# Altium schematic sheet HDMI.SchDoc
size A4; SheetNumber: 4; SheetTotal: 11
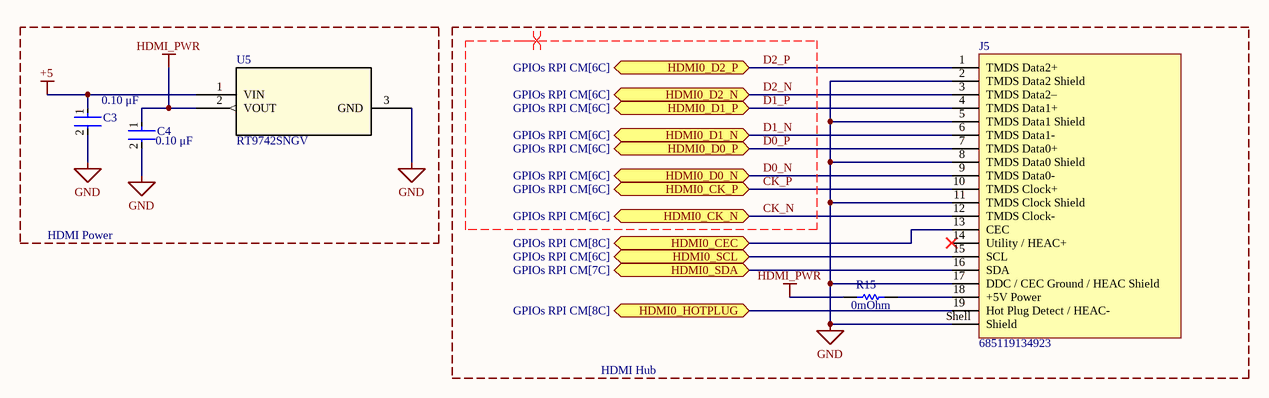
[diagram p0: HDMI.SchDoc]

## Parts
C3  Capacitance: 0.10 μF  [FP-C0402-BB-MFG]  (hidden comment: C0402C104K8PACTU)
C4  Capacitance: 0.10 μF  [FP-C0402-BB-MFG]  (hidden comment: C0402C104K8PACTU)
J5  685119134923  [685119134923]
R15  Resistance: 0mOhm  [RESC1005X40X25LL05T05]  (hidden comment: ERJ2GE0R00X)
U5  RT9742SNGV  [SOT_42SNGV_RIT]

## Blocks framed on the sheet
HDMI Power: C3 C4 U5
HDMI Hub: J5 R15

## Ports
HDMI0_CEC (bidir, see GPIOs RPI CM[8C]), HDMI0_CK_N (bidir, see GPIOs RPI CM[6C]), HDMI0_CK_P (bidir, see GPIOs RPI CM[6C]), HDMI0_D0_N (bidir, see GPIOs RPI CM[6C]), HDMI0_D0_P (bidir, see GPIOs RPI CM[6C]), HDMI0_D1_N (bidir, see GPIOs RPI CM[6C]), HDMI0_D1_P (bidir, see GPIOs RPI CM[6C]), HDMI0_D2_N (bidir, see GPIOs RPI CM[6C]), HDMI0_D2_P (bidir, see GPIOs RPI CM[6C]), HDMI0_HOTPLUG (bidir, see GPIOs RPI CM[8C]), HDMI0_SCL (bidir, see GPIOs RPI CM[6C]), HDMI0_SDA (bidir, see GPIOs RPI CM[7C])

## Nets
+5: C3.1 U5.1(VIN)
GND: C3.2 C4.2 J5.2(TMDS_Data2_Shield) J5.5(TMDS_Data1_Shield) J5.8(TMDS_Data0_Shield) J5.11(TMDS_Clock_Shield) J5.17(DDC_/_CEC_Ground_/_HEAC_Shield) J5.Shell(Shield) U5.3(GND)
HDMI_PWR: C4.1 R15.1 U5.2(VOUT)
CK_N: J5.12(TMDS_Clock-) ; port HDMI0_CK_N
CK_P: J5.10(TMDS_Clock+) ; port HDMI0_CK_P
D0_N: J5.9(TMDS_Data0-) ; port HDMI0_D0_N
D0_P: J5.7(TMDS_Data0+) ; port HDMI0_D0_P
D1_N: J5.6(TMDS_Data1-) ; port HDMI0_D1_N
D1_P: J5.4(TMDS_Data1+) ; port HDMI0_D1_P
D2_N: J5.3(TMDS_Data2–) ; port HDMI0_D2_N
D2_P: J5.1(TMDS_Data2+) ; port HDMI0_D2_P
HDMI0_CEC: J5.13(CEC) ; port HDMI0_CEC
HDMI0_HOTPLUG: J5.19(Hot_Plug_Detect_/_HEAC-) ; port HDMI0_HOTPLUG
HDMI0_SCL: J5.15(SCL) ; port HDMI0_SCL
HDMI0_SDA: J5.16(SDA) ; port HDMI0_SDA
NetJ5_18: J5.18(+5V_Power) R15.2

Not connected (* = marked no-connect by the designer): J5 14(Utility_/_HEAC+)*

## Layout directives
differential pair: CK_N, CK_P, D0_N, D0_P, D1_N, D1_P, D2_N, D2_P

## Library data of the parts
C3 C4 = CMP-2008-02046-2: CAP CER 0.1UF 10V X5R 0402; Manufacturer: Kemet; Material: Ceramic; Temperature Coefficient: 15%; Tolerance: 0.1; Value: 0.10 μF; Package: C0402-BB; Temperature: -55°C to +125°C; ComponentLink2Description: Datasheet; Temperature Characteristic: X5R; Device Class L1: Passive Components; Height: 0.55mm; Lead Free: Yes; ComponentLink2URL: https://content.kemet.com/datasheets/KEM_C1002_X7R_SMD.pdf; Device Class L2: Capacitors; Temperature Range Low: -55°C; Temperature Range High: +125°C; RoHS: TRUE; Octopart: https://octopart.com/c0402c104k8pactu-kemet-140039; Automotive: No; Mouser Description: Capacitor 100 nF 10 VDC 0402; Category: Cap; Voltage Rating: 10 V; Digikey Description: CAP CER 0.1UF 10V X5R 0402; Ipc Land Pattern Name: CAPC10050X50; Device Class L3: Ceramic Capacitors; Manufacturer Part Number: C0402C104K8PACTU
J5 = CMP-1502-00169-3: NexarPartId: 18818285; Connector Type: HDMI; Contact Resistance: 30mΩ; Current Rating: 500mA; Gender: Receptacle; Insulation Resistance: 10MΩ; Number of Contacts: 19; Body Material: Plastic; Voltage Rating: 40V; REACH SVHC: Unknown; Length: 12.15mm; Orientation: Horizontal; Packaging: Tape and Reel; Number of Pins: 19; Min Operating Temperature: -25°C; Termination: SMD/SMT; Height: 5.55mm; Features: Shielded; Number of Positions: 19; Width: 15mm; Mount: Horizontal, Surface Mount; Color: Black; Contact Material: Bronze, Gold; RoHS: Compliant; Max Operating Temperature: 85°C
R15 = CMP-2000-07451-1: Chip Resistor, 0 Ohm, 0.1 W, -55 to 155 degC, 0402 (1005 Metric), RoHS, Tape and Reel; Manufacturer: Panasonic; Voltage Rating (DC): 50V; Temperature Coefficient: 600ppm/��C; Max Power Dissipation: 100mW; Tolerance: 5%; Number of Terminations: 2; Mount: SurfaceMount; Height: 0.35mm; Packaging: TapeandReel; Contact Plating: Tin; Manufacturer URL: http://www.panasonic.com/; Composition: ThickFilm; Max Operating Temperature: 155degC; REACH SVHC: NoSVHC; Case/Package: 0402; Package Reference: 402; Depth: 0.5mm; Package Description: 2-Pin Surface Mount Device, Body 1 x 0.5 mm; Datasheet URL: https://industrial.panasonic.com/cdbs/www-data/pdf/RDA0000/AOA0000C301.pdf; RoHSCompliant: True; Case Code (Imperial): 0402; Military Standard: Not; Min Operating Temperature: -55degC; Power Rating: 100mW; Datasheet Version: 03/2015; Length: 1mm; Case Code (Metric): 1005; Termination: SMD/SMT; Mounting Technology: SurfaceMount; Voltage Rating: 50V; Width: 0.02inch; Package Quantity: 1; Lead Free: LeadFree; Radiation Hardening: No
U5 = RT9742SNGV: HDMI Power; Mfr_Name: Richtek Technology; RefDes: RefDes; Type: Type